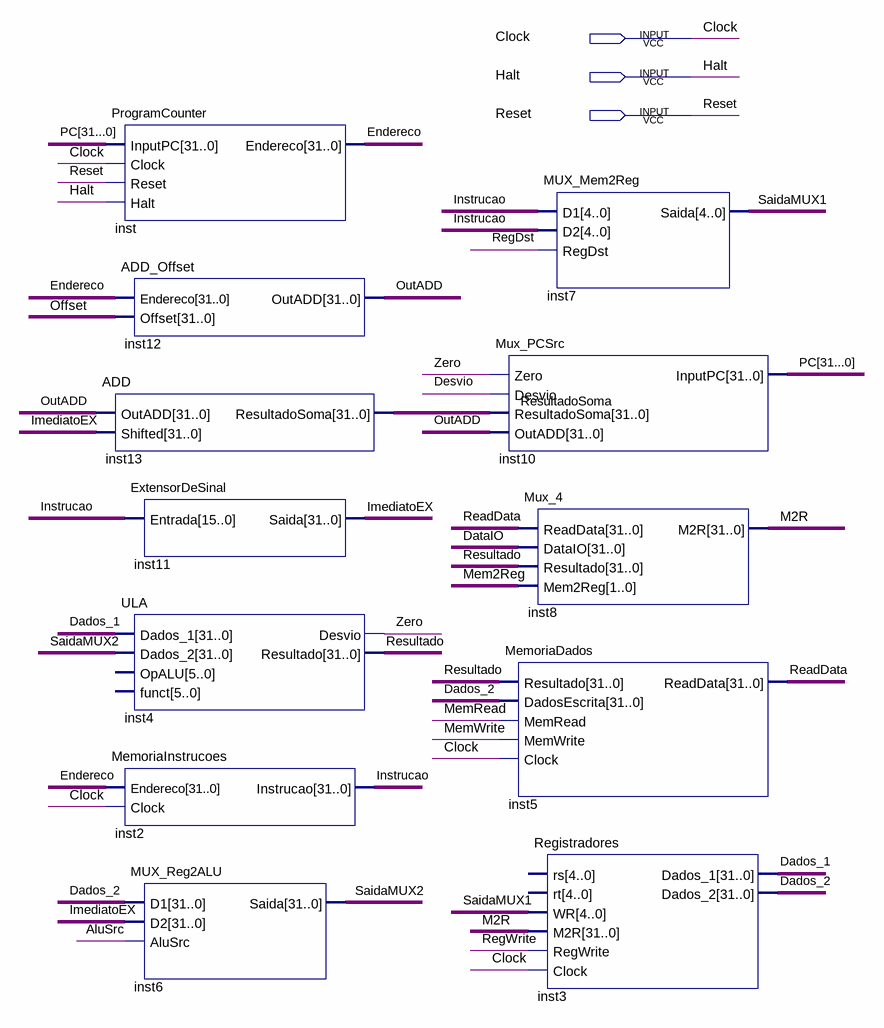
[diagram p0: schematic sheet]
// Quartus schematic Esquematico.bdf as structural Verilog: 12 symbols, 3 pins
module Esquematico (
  input  Clock,
  input  Halt,
  input  Reset
);

  wire AluSrc, Dados_1, Dados_2, DataIO, Desvio, Endereco, ImediatoEX, Instrucao, M2R, Mem2Reg, MemRead,
       MemWrite, Offset, OutADD, \PC[31...0] , ReadData, RegDst, RegWrite, Resultado, ResultadoSoma,
       SaidaMUX1, SaidaMUX2, Zero;

  ProgramCounter inst (.InputPC({32{\PC[31...0] }}), .Clock(Clock), .Reset(Reset), .Halt(Halt), .Endereco(Endereco));
  ADD inst13 (.OutADD({32{OutADD}}), .Shifted({32{ImediatoEX}}), .ResultadoSoma(ResultadoSoma));
  MemoriaInstrucoes inst2 (.Endereco({32{Endereco}}), .Clock(Clock), .Instrucao(Instrucao));
  ADD_Offset inst12 (.Endereco({32{Endereco}}), .Offset({32{Offset}}), .OutADD(OutADD));
  ExtensorDeSinal inst11 (.Entrada({16{Instrucao}}), .Saida(ImediatoEX));
  ULA inst4 (
    .Dados_1({32{Dados_1}}), .Dados_2({32{SaidaMUX2}}), .Desvio(Zero), .Resultado(Resultado));  // open: OpALU, funct
  MUX_Reg2ALU inst6 (.D1({32{Dados_2}}), .D2({32{ImediatoEX}}), .AluSrc(AluSrc), .Saida(SaidaMUX2));
  Mux_PCSrc inst10 (
    .Zero(Zero), .Desvio(Desvio), .ResultadoSoma({32{ResultadoSoma}}), .OutADD({32{OutADD}}),
    .InputPC(\PC[31...0] ));
  MUX_Mem2Reg inst7 (.D1({5{Instrucao}}), .D2({5{Instrucao}}), .RegDst(RegDst), .Saida(SaidaMUX1));
  Mux_4 inst8 (
    .ReadData({32{ReadData}}), .DataIO({32{DataIO}}), .Resultado({32{Resultado}}), .Mem2Reg({2{Mem2Reg}}),
    .M2R(M2R));
  MemoriaDados inst5 (
    .Resultado({32{Resultado}}), .DadosEscrita({32{Dados_2}}), .MemRead(MemRead), .MemWrite(MemWrite),
    .Clock(Clock), .ReadData(ReadData));
  Registradores inst3 (
    .WR({5{SaidaMUX1}}), .M2R({32{M2R}}), .RegWrite(RegWrite), .Clock(Clock), .Dados_1(Dados_1),
    .Dados_2(Dados_2));  // open: rs, rt
endmodule
